# Altium schematic sheet Low Noise 5V Ref.SchDoc
size A
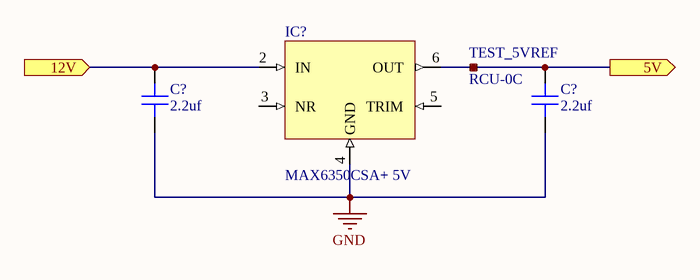
[diagram p0: Low Noise 5V Ref.SchDoc]

## Parts
(Parts that share a designator on the sheet are numbered #1, #2 ... from top to bottom, then left to right.)
C?#1  value 2.2uf  [CAP 0805/2012]  (hidden comment: Capacitor MLCC 2.2uf 25V CAP 0805/2012)
C?#2  value 2.2uf  [CAP 0805/2012]  (hidden comment: Capacitor MLCC 2.2uf 25V CAP 0805/2012)
IC?  MAX6350CSA+ 5V  [SOIC-8]
TEST_5VREF  RCU-0C  [RCU-0C]

## Ports
5V (out), 12V (in)

## Nets
GND: C?#1.1 C?#2.1 IC?.4(GND)
5V: C?#2.2 IC?.6(OUT) TEST_5VREF.1 ; port 5V
12V: C?#1.2 IC?.2(IN) ; port 12V

Not connected (* = marked no-connect by the designer): IC? 3(NR) 5(TRIM)

## Library data of the parts
C?#1 C?#2 = 711: Manufacturer_id: 1; idCapacitor: 711; Name: Cap_2.2uf_25V_CAP 0805/2012; Dielectric: Ceramic; Created_By: Nick Mah; Drawer_id: 1; Voltage_Rating: 25V; Package: CAP 0805/2012; Created_Date: 10/20/2018
IC? = 10: IC VREF SERIES 5V 8SOIC; Manufacturer_id: 1; idPMIC_Lin: 10; Name: MAX6350CSA+_5V_Ref; Vin(Max): 40V; Vout(Max): 12V; Created_By: Albert Panuco; Drawer_id: 1; Value: 5V; Output_Config: 5V; Num_Outputs: 1; Package: SOIC-8; MfrPartNo: MAX6350CSA+; Link: https://www.digikey.com/product-detail/en/maxim-integrated/MAX6350CSA/MAX6350CSA-ND/1867176; Updated_By: Albert Panuco
TEST_5VREF = 5: Manufacturer_id: 1; idTable: 5; Name: RCU-0C_Test_Point; Drawer_id: 1; Package: 0603; MfrPartNo: RCU-0C; Link: https://www.digikey.com/product-detail/en/te-connectivity-amp-connectors/RCU-0C/A106145CT-ND/3477802; ComponentLink1Description: Datasheet; ComponentLink1URL: https://www.te.com/commerce/DocumentDelivery/DDEController?Action=srchrtrv&DocNm=1773266&DocType=DS&DocLang=English